# Altium schematic sheet 02_B_TO_B_CON.SchDoc: PixHack V5 Base v1.82
size A4; CompanyName: CUAV Ltd; DrawnBy: bin; Revision: V1.82
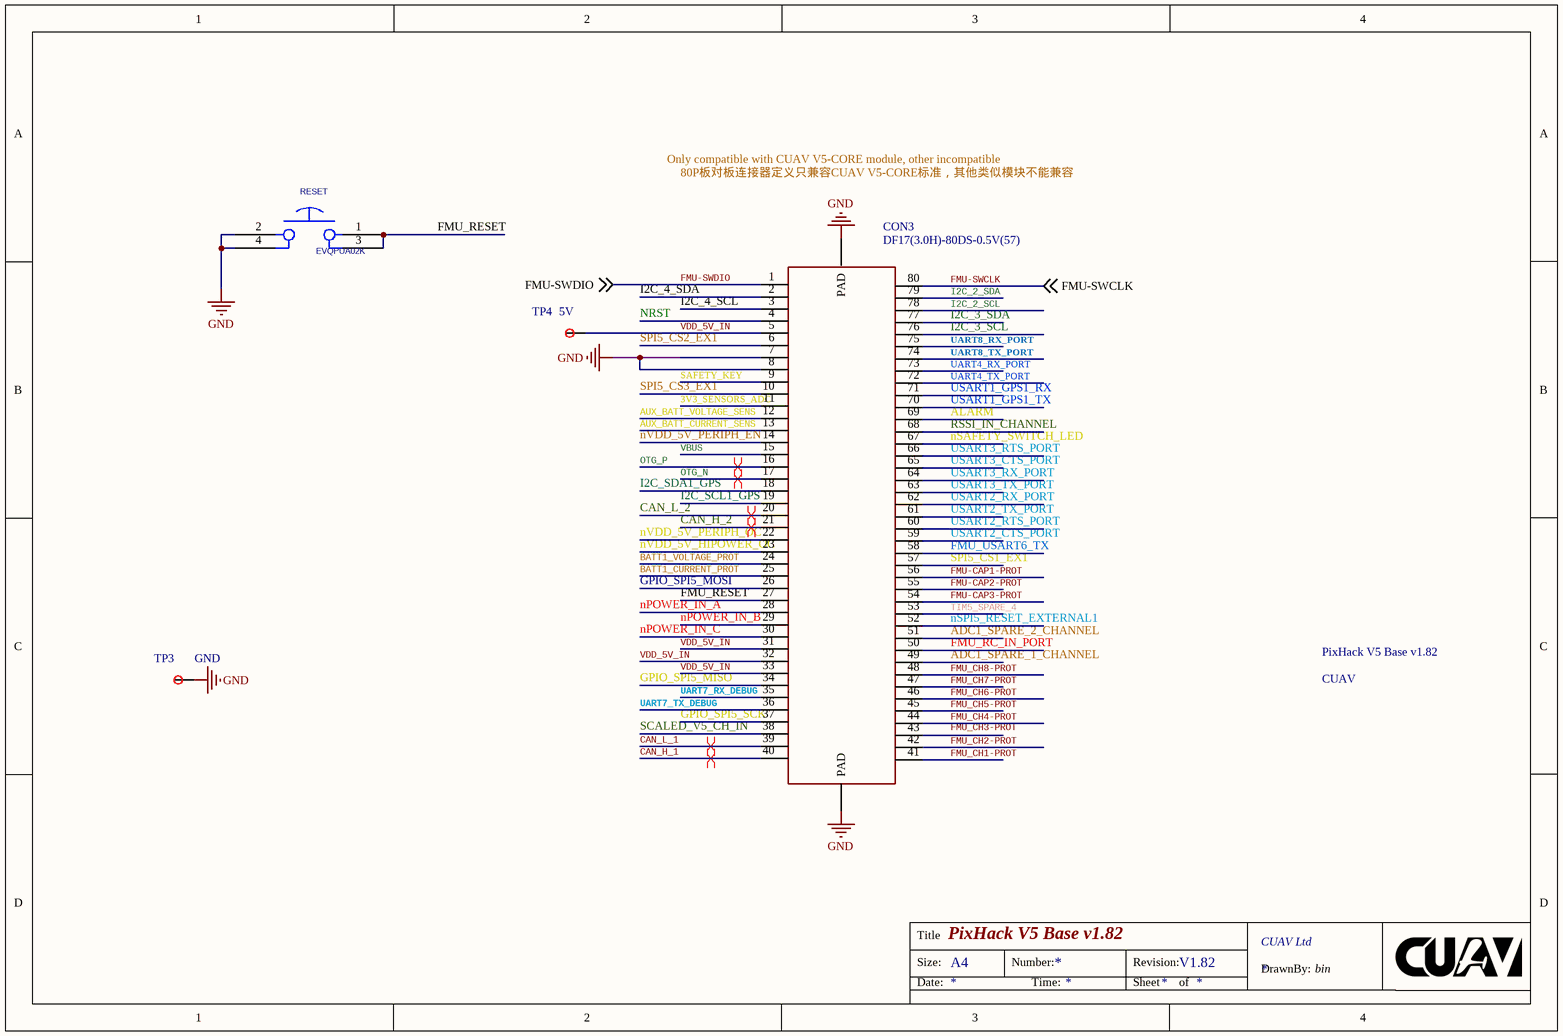
[diagram p0: 02_B_TO_B_CON.SchDoc]

## Parts
CON3  DF17(3.0H)-80DS-0.5V(57)  [DF17(3.0H)-80DS-0.5V(57)]
PixHack_V5_Base_v1.82  CUAV  [CUAV_G]
RESET  EVQPUA02K  [SKRPAB]
TP3  GND  [TP0.75]
TP4  5V  [TP0.75]

## Nets
GND: CON3.7 CON3.8 CON3.PAD RESET.2 RESET.4 TP3.0
3V3_SENSORS_ADC: CON3.11
ADC1_SPARE_1_CHANNEL: CON3.49
ADC1_SPARE_2_CHANNEL: CON3.51
ALARM: CON3.69
AUX_BATT_CURRENT_SENS: CON3.13
AUX_BATT_VOLTAGE_SENS: CON3.12
BATT1_CURRENT_PROT: CON3.25
BATT1_VOLTAGE_PROT: CON3.24
CAN_H_1: CON3.40
CAN_H_2: CON3.21
CAN_L_1: CON3.39
CAN_L_2: CON3.20
FMU-CAP1-PROT: CON3.56
FMU-CAP2-PROT: CON3.55
FMU-CAP3-PROT: CON3.54
FMU-SWCLK: CON3.80 ; off-sheet FMU-SWCLK
FMU-SWDIO: CON3.1 ; off-sheet FMU-SWDIO
FMU_CH1-PROT: CON3.41
FMU_CH2-PROT: CON3.42
FMU_CH4-PROT: CON3.44
FMU_CH5-PROT: CON3.45
FMU_CH6-PROT: CON3.46
FMU_CH7-PROT: CON3.47
FMU_CH8-PROT: CON3.48
FMU_RC_IN_PORT: CON3.50
FMU_RESET: CON3.27 RESET.1 RESET.3
FMU_USART6_TX: CON3.58
GPIO_SPI5_MISO: CON3.34
GPIO_SPI5_MOSI: CON3.26
GPIO_SPI5_SCK: CON3.37
I2C_2_SCL: CON3.78
I2C_2_SDA: CON3.79
I2C_3_SCL: CON3.76
I2C_3_SDA: CON3.77
I2C_4_SCL: CON3.3
I2C_4_SDA: CON3.2
I2C_SCL1_GPS: CON3.19
I2C_SDA1_GPS: CON3.18
nPOWER_IN_A: CON3.28
nPOWER_IN_B: CON3.29
nPOWER_IN_C: CON3.30
NRST: CON3.4
nSAFETY_SWITCH_LED: CON3.67
nSPI5_RESET_EXTERNAL1: CON3.52
nVDD_5V_HIPOWER_OC: CON3.23
nVDD_5V_PERIPH_EN: CON3.14
nVDD_5V_PERIPH_OC: CON3.22
OTG_N: CON3.17
OTG_P: CON3.16
RSSI_IN_CHANNEL: CON3.68
SAFETY_KEY: CON3.9
SCALED_V5_CH_IN: CON3.38
SPI5_CS1_EX1: CON3.57
SPI5_CS2_EX1: CON3.6
SPI5_CS3_EX1: CON3.10
TIM5_SPARE_4: CON3.53
UART4_RX_PORT: CON3.73
UART4_TX_PORT: CON3.72
UART7_RX_DEBUG: CON3.35
UART7_TX_DEBUG: CON3.36
UART8_RX_PORT: CON3.75
UART8_TX_PORT: CON3.74
USART1_GPS1_RX: CON3.71
USART1_GPS1_TX: CON3.70
USART2_CTS_PORT: CON3.59
USART2_RTS_PORT: CON3.60
USART2_RX_PORT: CON3.62
USART2_TX_PORT: CON3.61
USART3_CTS_PORT: CON3.65
USART3_RTS_PORT: CON3.66
USART3_RX_PORT: CON3.64
USART3_TX_PORT: CON3.63
VBUS: CON3.15
VDD_5V_IN: CON3.5 CON3.31 CON3.32 CON3.33 TP4.0

Not connected (* = marked no-connect by the designer): CON3 43

## Layout directives
differential pair: CAN_H_1, CAN_H_2, CAN_L_1, CAN_L_2, OTG_N, OTG_P

## Notes on the sheet
- Labels drawn without touching a wire or pin: 80P板对板连接器定义只兼容CUAV V5-CORE标准，其他类似模块不能兼容, FMU_CH3-PROT, Only compatible with CUAV V5-CORE module, other incompatible
- Title
- Size:
- Date:
- A4
- Number:
- Time:
- Revision:
- Sheet
- of
- DrawnBy:

## Library data of the parts
RESET = EDGE_MOUNT_PB_SW_2: SW SPST NO PB 2.2N SIDE 12V 50MA SMT; CLASS: IC; CAD_APPROVED: Yes; MFG_NAME01: PANASONIC; AGILE_PN: 510-76838; HEIGHT: 1.95MM; ROHS: Yes; MFG_PN01: EVQPUA02K
TP3 TP4 = TP_0.75: TP_0.75MM